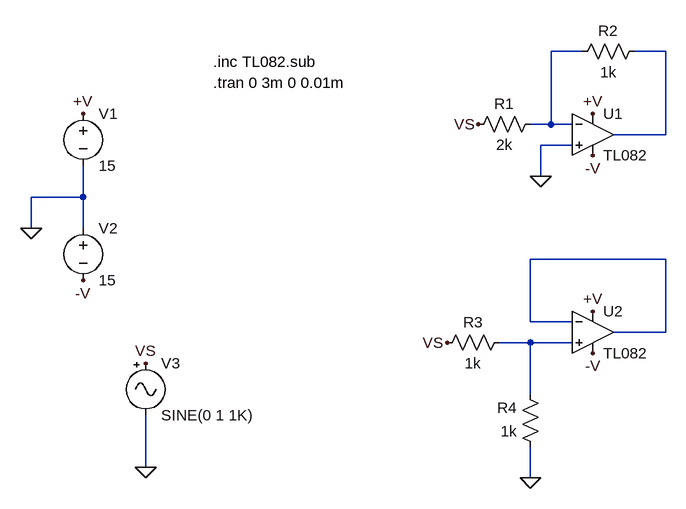
[diagram p0: schematic EntradaDiferencial.asc]
EntradaDiferencial.asc, the LTspice schematic file:
Version 4
SHEET 1 880 680
WIRE 208 -64 160 -64
WIRE 336 -64 288 -64
WIRE 160 48 160 -64
WIRE 160 48 128 48
WIRE 192 48 160 48
WIRE 336 64 336 -64
WIRE 336 64 256 64
WIRE 192 80 144 80
WIRE 144 128 144 80
WIRE -560 160 -560 112
WIRE -560 160 -640 160
WIRE -640 208 -640 160
WIRE -560 208 -560 160
WIRE 336 256 128 256
WIRE 128 352 128 256
WIRE 192 352 128 352
WIRE 336 368 336 256
WIRE 336 368 256 368
WIRE 128 384 80 384
WIRE 192 384 128 384
WIRE 128 464 128 384
WIRE -464 576 -464 496
WIRE 128 592 128 544
FLAG -640 208 0
FLAG -560 32 +V
FLAG -560 288 -V
FLAG -464 576 0
FLAG -464 416 VS
FLAG 224 32 +V
FLAG 224 336 +V
FLAG 224 96 -V
FLAG 224 400 -V
FLAG 144 128 0
FLAG 128 592 0
FLAG 48 48 VS
FLAG 0 384 VS
SYMBOL Opamps\\opamp2 224 0 R0
SYMATTR InstName U1
SYMATTR Value TL082
SYMBOL Opamps\\opamp2 224 304 R0
SYMATTR InstName U2
SYMATTR Value TL082
SYMBOL res 144 32 R90
WINDOW 0 0 56 VBottom 2
WINDOW 3 32 56 VTop 2
SYMATTR InstName R1
SYMATTR Value 2k
SYMBOL res 304 -80 R90
WINDOW 0 0 56 VBottom 2
WINDOW 3 32 56 VTop 2
SYMATTR InstName R2
SYMATTR Value 1k
SYMBOL res 96 368 R90
WINDOW 0 0 56 VBottom 2
WINDOW 3 32 56 VTop 2
SYMATTR InstName R3
SYMATTR Value 1k
SYMBOL res 144 560 R180
WINDOW 0 36 76 Left 2
WINDOW 3 36 40 Left 2
SYMATTR InstName R4
SYMATTR Value 1k
SYMBOL voltage -560 16 R0
WINDOW 123 0 0 Left 2
WINDOW 39 0 0 Left 2
SYMATTR InstName V1
SYMATTR Value 15
SYMBOL voltage -560 192 R0
WINDOW 123 0 0 Left 2
WINDOW 39 0 0 Left 2
SYMATTR InstName V2
SYMATTR Value 15
SYMBOL Misc\\signal -464 400 R0
WINDOW 123 0 0 Left 2
WINDOW 39 0 0 Left 2
SYMATTR InstName V3
TEXT -360 -16 Left 2 !.tran 0 3m 0 0.01m
TEXT -360 -48 Left 2 !.inc TL082.sub

The netlist it stands for:
* EntradaDiferencial.asc
XU1 0 N001 +V -V N002 TL082  ; pins In+ In- V+ V- OUT
XU2 N004 N003 +V -V N003 TL082  ; pins In+ In- V+ V- OUT
R1 N001 VS 2k
R2 N002 N001 1k
R3 N004 VS 1k
R4 0 N004 1k
V1 +V 0 15
V2 0 -V 15
V3 VS 0 SINE(0 1 1K)
.tran 0 3m 0 0.01m
.inc TL082.sub
.backanno
.end